# Altium schematic sheet main_board.SchDoc
size A3
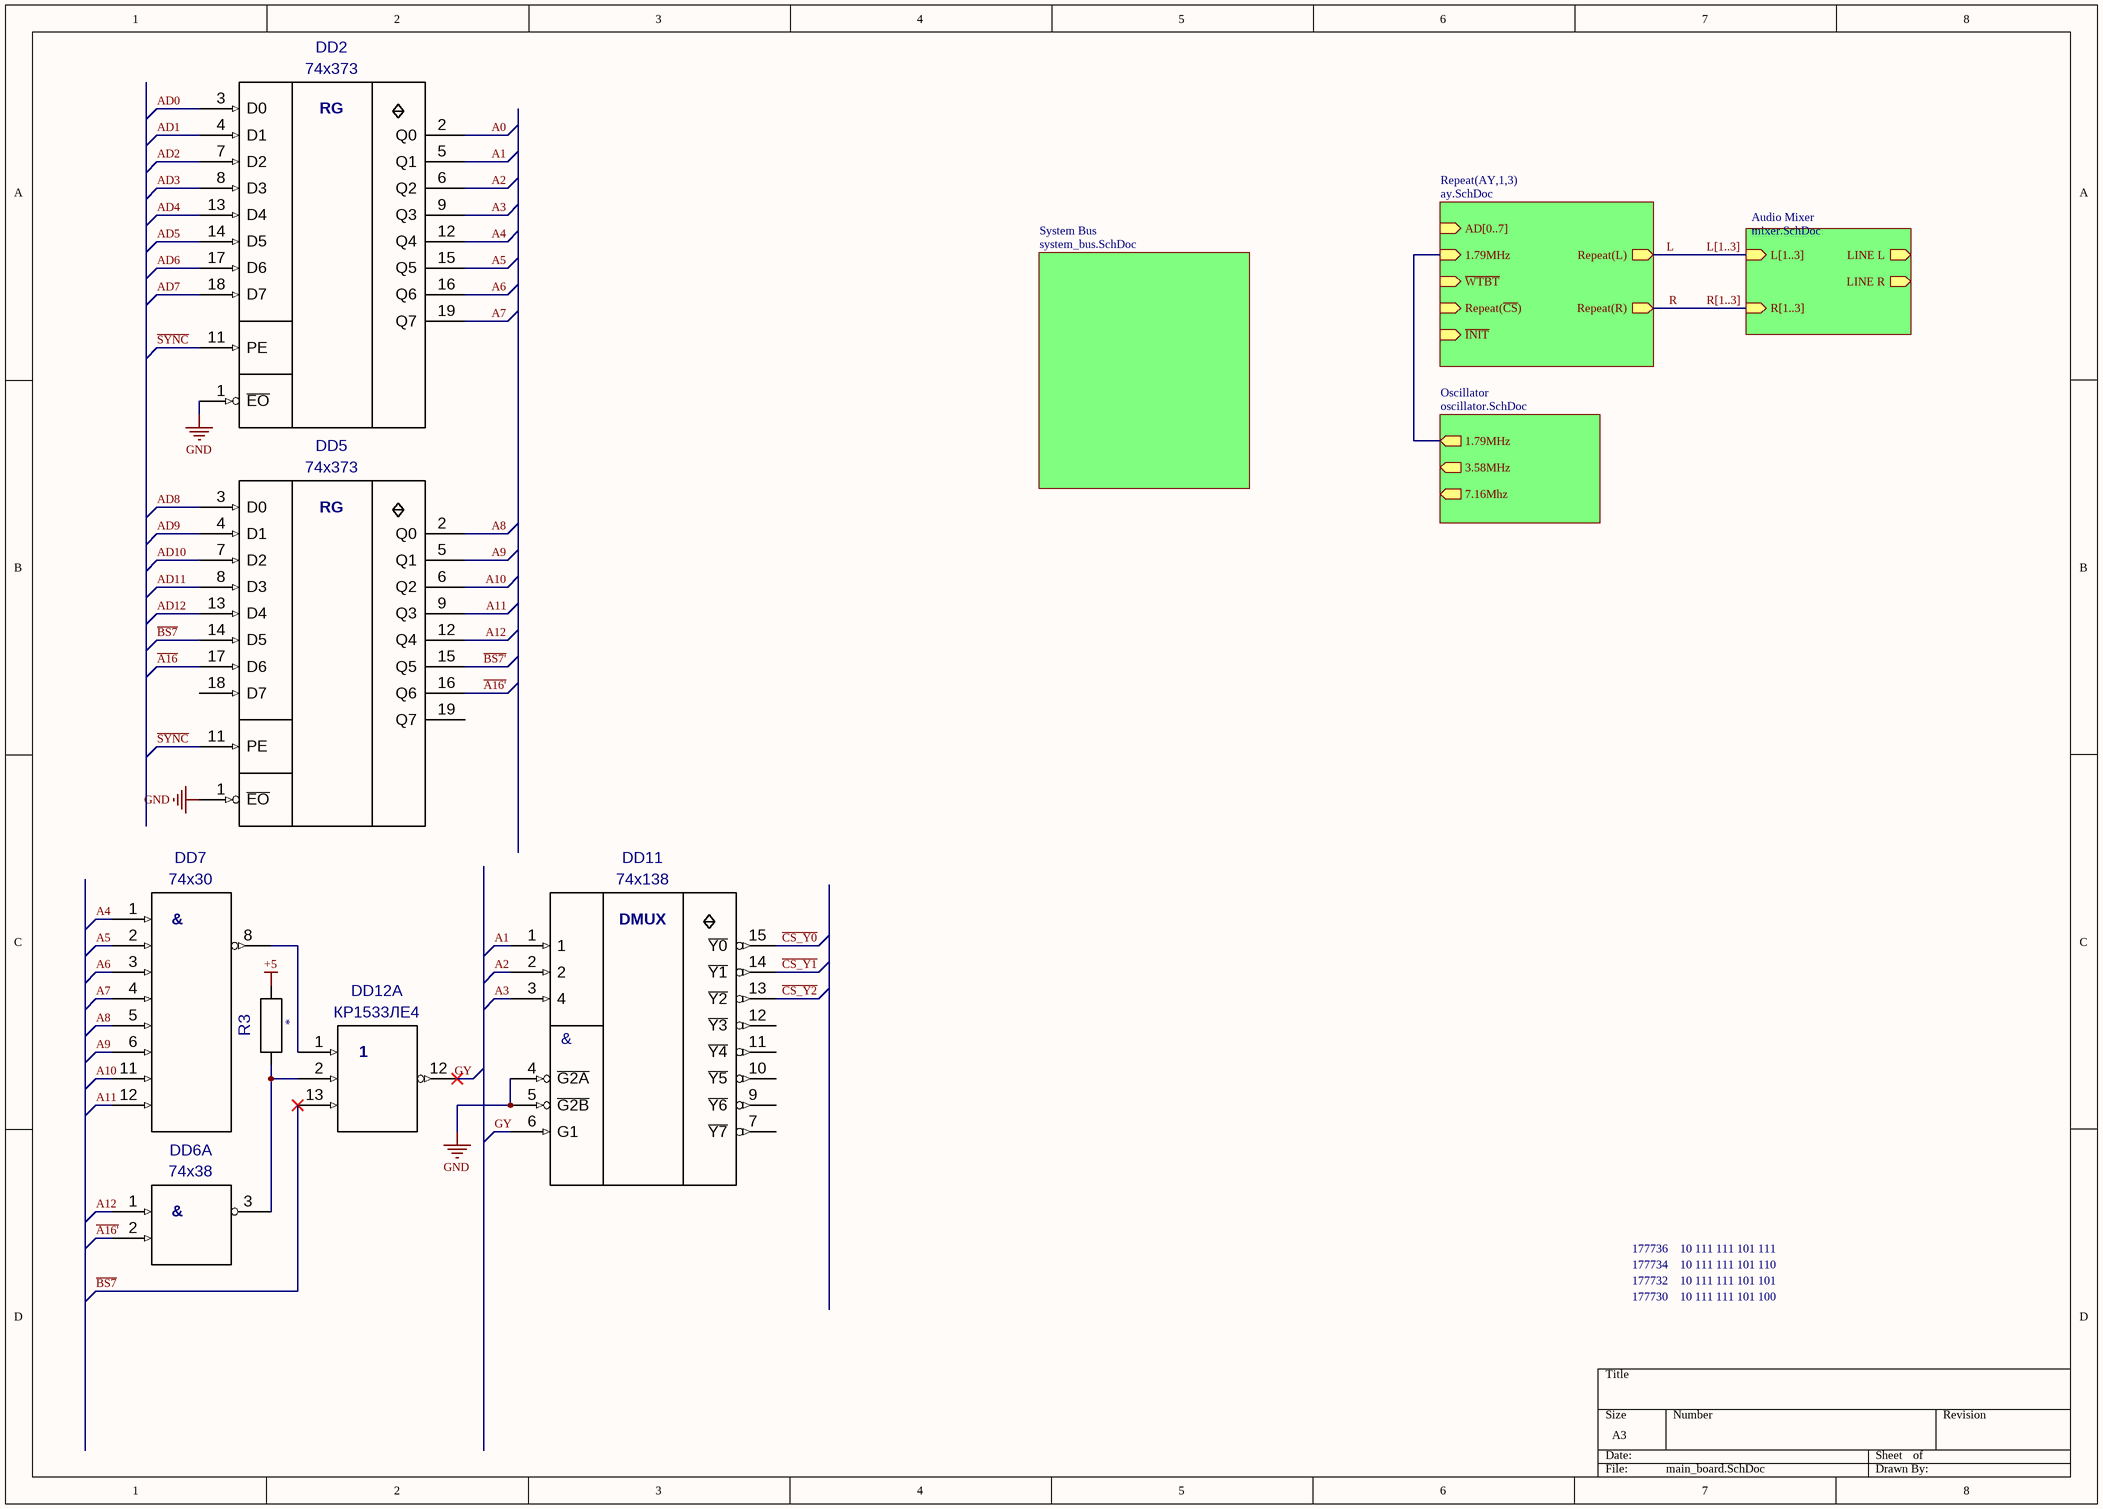
[diagram p0: main_board.SchDoc]

## Parts
DD2  74x373  [DIP20]
DD5  74x373  [DIP20]
DD6  74x38  [DIP14]  (part A of 4)
DD7  74x30  [DIP14]
DD11  74x138  [DIP16]
DD12  КР1533ЛЕ4  [DIP14]  (part A of 3)
R3  R0125A  [AXIAL-0.3]  (value not drawn)

## Sub-sheets
Audio Mixer = mixer.SchDoc: LINE L (out), R[1..3] (in), LINE R (out), L[1..3] (in)
Oscillator = oscillator.SchDoc: 1.79MHz (out), 3.58MHz (out), 7.16Mhz (out)
Repeat(AY,1,3) = ay.SchDoc: Repeat(~{CS}) (in), Repeat(L) (out), ~{INIT} (in), AD[0..7] (in), ~{WTBT} (in), 1.79MHz (in), Repeat(R) (out)
System Bus = system_bus.SchDoc: no entries

## Nets
+5: R3.2(I/OB)
GND: DD2.1(~{EO}) DD5.1(~{EO}) DD11.4(~{G2A}) DD11.5(~{G2B})
A0: DD2.2(Q0)
A1: DD2.5(Q1) DD11.1
A2: DD2.6(Q2) DD11.2
A3: DD2.9(Q3) DD11.3(4)
A4: DD2.12(Q4) DD7.1
A5: DD2.15(Q5) DD7.2
A6: DD2.16(Q6) DD7.3
A7: DD2.19(Q7) DD7.4
A8: DD5.2(Q0) DD7.5
A9: DD5.5(Q1) DD7.6
A10: DD5.6(Q2) DD7.11
A11: DD5.9(Q3) DD7.12
A12: DD5.12(Q4) DD6.1
~{A16}: DD5.17(D6)
~{A16'}: DD5.16(Q6) DD6.2
AD0: DD2.3(D0)
AD1: DD2.4(D1)
AD2: DD2.7(D2)
AD3: DD2.8(D3)
AD4: DD2.13(D4)
AD5: DD2.14(D5)
AD6: DD2.17(D6)
AD7: DD2.18(D7)
AD8: DD5.3(D0)
AD9: DD5.4(D1)
AD10: DD5.7(D2)
AD11: DD5.8(D3)
AD12: DD5.13(D4)
~{BS7}: DD5.14(D5) DD12.13
~{BS7'}: DD5.15(Q5)
~{CS_Y0}: DD11.15(~{Y0})
~{CS_Y1}: DD11.14(~{Y1})
~{CS_Y2}: DD11.13(~{Y2})
GY: DD11.6(G1) DD12.12
L: sheet Repeat(AY,1,3)/Repeat(L)
R: sheet Repeat(AY,1,3)/Repeat(R)
~{SYNC}: DD2.11(PE) DD5.11(PE)
NetDD6_3: DD6.3 DD12.2 R3.1(I/OA)
NetDD7_8: DD7.8 DD12.1
(unnamed): sheet Repeat(AY,1,3)/1.79MHz, sheet Oscillator/1.79MHz

Not connected (* = marked no-connect by the designer): DD2 10(GND) 20(+5V); DD5 10(GND) 18(D7) 19(Q7) 20(+5V); DD6 7(GND) 14(+5); DD7 7(GND) 14(+5); DD11 7(~{Y7}) 8(GND) 9(~{Y6}) 10(~{Y5}) 11(~{Y4}) 12(~{Y3}) 16(+5); DD12 7(GND) 14(+5V)

## Buses and harness runs
bus L[1..3] = sheet Audio Mixer/L[1..3]
bus R[1..3] = sheet Audio Mixer/R[1..3]

## Notes on the sheet
- 177736
- 10 111 111 101 111
- 177734
- 177732
- 177730
- 10 111 111 101 110
- 10 111 111 101 101
- 10 111 111 101 100
- (in symbol 74x30) &
- (in symbol 74x38, part A) &
- (in symbol 74x138) DMUX; &
- (in symbol 74x373) RG

## Library data of the parts
DD2 DD5 = 74x373: ИР22 transparent latch; Value: *
DD6 = 74x38: ЛА13 4x2NAND O.C.; Value: *
DD7 = 74x30: ЛА2 8NAND; Value: *
DD11 = 74x138: ИД7 3 to 8 DEMUX; Value: *
DD12 = КР1533ЛЕ4(74ALS27): Value: *
R3 = R0125A: PDIF_TY: 11107; Value: *